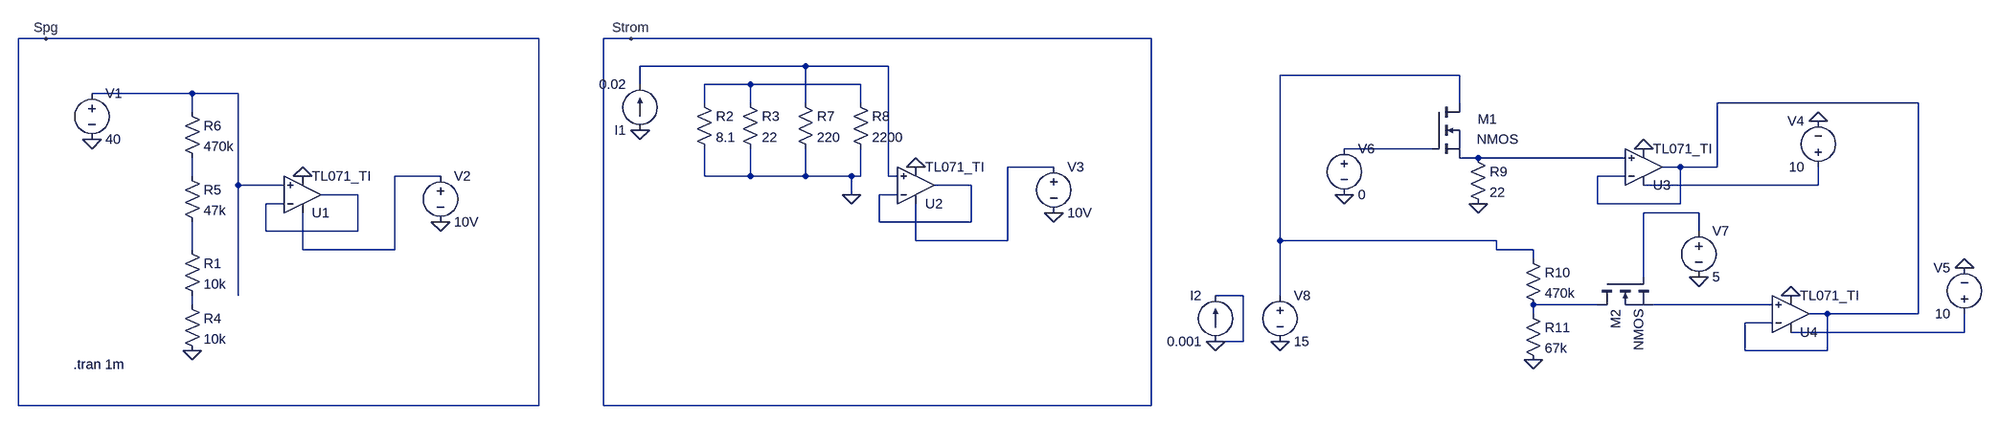
[diagram p0: schematic Testing.asc]
Testing.asc, the LTspice schematic file:
Version 4
SHEET 1 3332 1120
WIRE -288 -144 -336 -144
WIRE 688 -144 -288 -144
WIRE 880 -144 832 -144
WIRE 1824 -144 880 -144
WIRE 1184 -96 896 -96
WIRE 1328 -96 1184 -96
WIRE 2416 -80 2048 -80
WIRE 896 -64 896 -96
WIRE 1088 -64 1008 -64
WIRE 1280 -64 1088 -64
WIRE 80 -48 -208 -48
WIRE 160 -48 80 -48
WIRE 1008 -32 1008 -64
WIRE 1088 -32 1088 -64
WIRE 1184 -32 1184 -96
WIRE 1280 -32 1280 -64
WIRE 2416 -32 2416 -80
WIRE 3216 -32 2864 -32
WIRE 80 -16 80 -48
WIRE 2368 48 2160 48
WIRE 2448 64 2416 64
WIRE 2704 64 2448 64
WIRE 1616 80 1536 80
WIRE 2800 80 2768 80
WIRE 2864 80 2864 -32
WIRE 2864 80 2800 80
WIRE 80 96 80 64
WIRE 512 96 432 96
WIRE 1008 96 1008 48
WIRE 1088 96 1088 48
WIRE 1088 96 1008 96
WIRE 1184 96 1184 48
WIRE 1184 96 1088 96
WIRE 1264 96 1184 96
WIRE 1280 96 1280 48
WIRE 1280 96 1264 96
WIRE 1328 96 1328 -96
WIRE 1344 96 1328 96
WIRE 2704 96 2656 96
WIRE 160 112 160 -48
WIRE 240 112 160 112
WIRE 1472 112 1408 112
WIRE 3040 112 3040 80
WIRE 3040 112 2736 112
WIRE 368 128 304 128
WIRE 1264 128 1264 96
WIRE 1344 128 1312 128
WIRE 240 144 208 144
WIRE 2656 144 2656 96
WIRE 2800 144 2800 80
WIRE 2800 144 2656 144
WIRE 2832 160 2736 160
WIRE 1312 176 1312 128
WIRE 1472 176 1472 112
WIRE 1472 176 1312 176
WIRE 208 192 208 144
WIRE 368 192 368 128
WIRE 368 192 208 192
WIRE 2832 192 2832 160
WIRE 1376 208 1376 144
WIRE 1536 208 1536 80
WIRE 1536 208 1376 208
WIRE 2048 208 2048 -80
WIRE 2480 208 2048 208
WIRE 80 224 80 176
WIRE 272 224 272 160
WIRE 432 224 432 96
WIRE 432 224 272 224
WIRE 2480 224 2480 208
WIRE 2544 224 2480 224
WIRE 2544 240 2544 224
WIRE 2736 272 2736 160
WIRE 160 304 160 112
WIRE 1984 304 1936 304
WIRE 2048 304 2048 208
WIRE 80 320 80 304
WIRE 2656 320 2544 320
WIRE 2960 320 2752 320
WIRE 2544 336 2544 320
WIRE 3056 336 3024 336
WIRE 3216 336 3216 -32
WIRE 3216 336 3056 336
WIRE 2960 352 2912 352
WIRE 3296 368 3296 336
WIRE 3296 368 2992 368
WIRE 1984 384 1984 304
WIRE 1984 384 1936 384
WIRE 2912 400 2912 352
WIRE 3056 400 3056 336
WIRE 3056 400 2912 400
WIRE -336 496 -336 -144
WIRE 688 496 688 -144
WIRE 688 496 -336 496
WIRE 832 496 832 -144
WIRE 1824 496 1824 -144
WIRE 1824 496 832 496
FLAG 80 400 0
FLAG -208 32 0
FLAG 272 96 0
FLAG 512 176 0
FLAG -288 -144 Spg
FLAG 896 16 0
FLAG 1376 80 0
FLAG 1616 160 0
FLAG 880 -144 Strom
FLAG 1264 128 0
FLAG 2544 416 0
FLAG 2448 144 0
FLAG 1936 384 0
FLAG 2048 384 0
FLAG 2160 128 0
FLAG 2832 272 0
FLAG 2736 48 0
FLAG 3040 0 0
FLAG 2992 304 0
FLAG 3296 256 0
SYMBOL EXTRA\\AudioOpamp\\TI\\TL071_TI 272 128 M180
SYMATTR InstName U1
SYMBOL res 64 304 R0
SYMATTR InstName R4
SYMATTR Value 10k
SYMBOL voltage -208 -64 R0
WINDOW 123 0 0 Left 0
WINDOW 39 0 0 Left 0
SYMATTR InstName V1
SYMATTR Value 40
SYMBOL voltage 512 80 R0
WINDOW 123 0 0 Left 0
WINDOW 39 0 0 Left 0
SYMATTR InstName V2
SYMATTR Value 10V
SYMBOL res 64 80 R0
SYMATTR InstName R5
SYMATTR Value 47k
SYMBOL res 64 -32 R0
SYMATTR InstName R6
SYMATTR Value 470k
SYMBOL res 64 208 R0
SYMATTR InstName R1
SYMATTR Value 10k
SYMBOL EXTRA\\AudioOpamp\\TI\\TL071_TI 1376 112 M180
SYMATTR InstName U2
SYMBOL res 992 -48 R0
SYMATTR InstName R2
SYMATTR Value 8.1
SYMBOL voltage 1616 64 R0
WINDOW 123 0 0 Left 0
WINDOW 39 0 0 Left 0
SYMATTR InstName V3
SYMATTR Value 10V
SYMBOL res 1072 -48 R0
SYMATTR InstName R3
SYMATTR Value 22
SYMBOL res 1168 -48 R0
SYMATTR InstName R7
SYMATTR Value 220
SYMBOL current 896 16 R180
WINDOW 123 0 0 Left 0
WINDOW 39 0 0 Left 0
SYMATTR InstName I1
SYMATTR Value 0.02
SYMBOL res 1264 -48 R0
SYMATTR InstName R8
SYMATTR Value 2200
SYMBOL nmos 2368 -32 R0
WINDOW 0 79 29 Left 2
WINDOW 3 78 64 Left 2
SYMATTR InstName M1
SYMBOL nmos 2656 272 M90
SYMATTR InstName M2
SYMBOL res 2432 48 R0
SYMATTR InstName R9
SYMATTR Value 22
SYMBOL res 2528 224 R0
SYMATTR InstName R10
SYMATTR Value 470k
SYMBOL res 2528 320 R0
SYMATTR InstName R11
SYMATTR Value 67k
SYMBOL voltage 2160 32 R0
WINDOW 123 0 0 Left 0
WINDOW 39 0 0 Left 0
SYMATTR InstName V6
SYMATTR Value 0
SYMBOL voltage 2832 176 R0
WINDOW 123 0 0 Left 0
WINDOW 39 0 0 Left 0
SYMATTR InstName V7
SYMATTR Value 5
SYMBOL voltage 2048 288 R0
WINDOW 123 0 0 Left 0
WINDOW 39 0 0 Left 0
SYMATTR InstName V8
SYMATTR Value 15
SYMBOL current 1936 384 R180
WINDOW 0 24 80 Left 2
WINDOW 3 24 0 Left 2
WINDOW 123 0 0 Left 0
WINDOW 39 0 0 Left 0
SYMATTR InstName I2
SYMATTR Value 0.001
SYMBOL EXTRA\\AudioOpamp\\TI\\TL071_TI 2736 80 M180
SYMATTR InstName U3
SYMBOL voltage 3040 96 R180
WINDOW 0 24 96 Left 2
WINDOW 3 24 16 Left 2
WINDOW 123 0 0 Left 0
WINDOW 39 0 0 Left 0
SYMATTR InstName V4
SYMATTR Value 10
SYMBOL EXTRA\\AudioOpamp\\TI\\TL071_TI 2992 336 M180
SYMATTR InstName U4
SYMBOL voltage 3296 352 R180
WINDOW 0 24 96 Left 2
WINDOW 3 24 16 Left 2
WINDOW 123 0 0 Left 0
WINDOW 39 0 0 Left 0
SYMATTR InstName V5
SYMATTR Value 10
TEXT -240 424 Left 2 !.tran 1m

The netlist it stands for:
* Testing.asc
* U1: TL071_TI (symbol EXTRA\AudioOpamp\TI\TL071_TI not available, pins judged from their places): In+=N004 In-=N013 V+=N010 V-=0 OUT=N013
R4 N016 0 10k
V1 N004 0 40
V2 N010 0 10V
R5 N009 N015 47k
R6 N004 N009 470k
R1 N015 N016 10k
* U2: TL071_TI (symbol EXTRA\AudioOpamp\TI\TL071_TI not available, pins judged from their places): In+=N001 In-=N011 V+=N008 V-=0 OUT=N011
R2 N003 0 8.1
V3 N008 0 10V
R3 N003 0 22
R7 N001 0 220
I1 0 N001 0.02
R8 N003 0 2200
M1 N002 N006 N007 N007 NMOS
M2 N017 N014 N018 N018 NMOS
R9 N007 0 22
R10 N002 N017 470k
R11 N017 0 67k
V6 N006 0 0
V7 N014 0 5
V8 N002 0 15
I2 0 0 0.001
* U3: TL071_TI (symbol EXTRA\AudioOpamp\TI\TL071_TI not available, pins judged from their places): In+=N007 In-=N005 V+=N012 V-=0 OUT=N005
V4 N012 0 10
* U4: TL071_TI (symbol EXTRA\AudioOpamp\TI\TL071_TI not available, pins judged from their places): In+=N018 In-=N005 V+=N019 V-=0 OUT=N005
V5 N019 0 10
.model NMOS NMOS
.model PMOS PMOS
.lib standard.mos
.tran 1m
.backanno
.end